# EAGLE board controller (EAGLE 9.6.0)
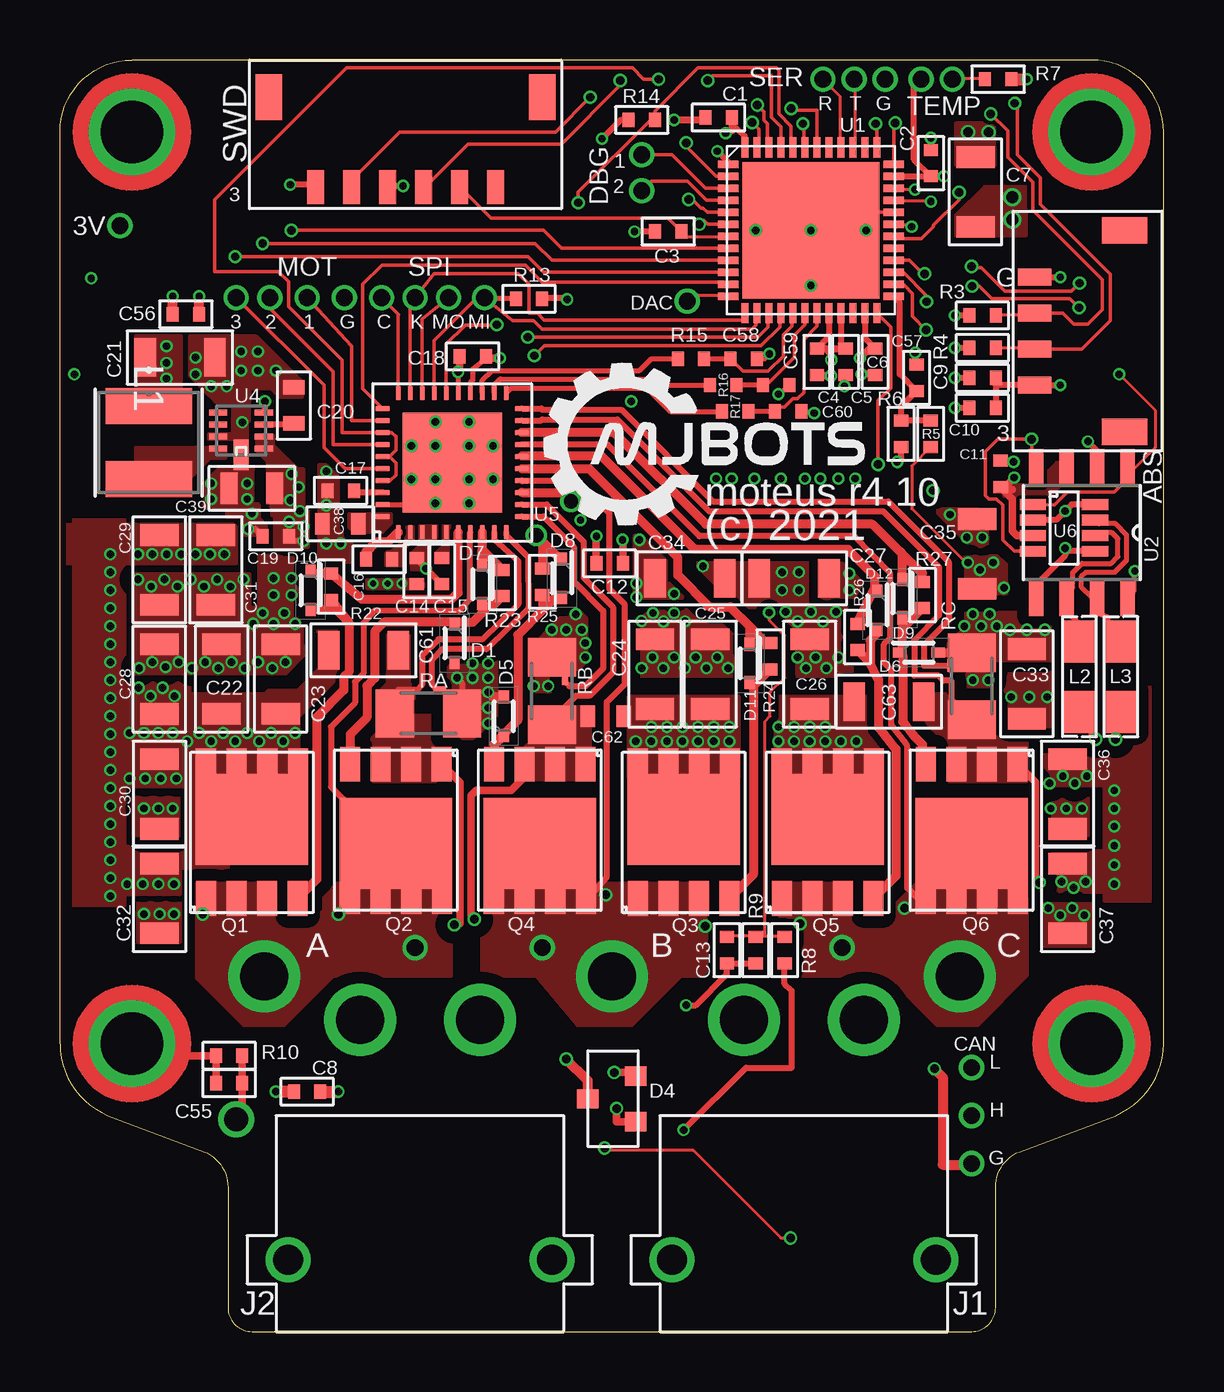
[diagram p5: board, top side]
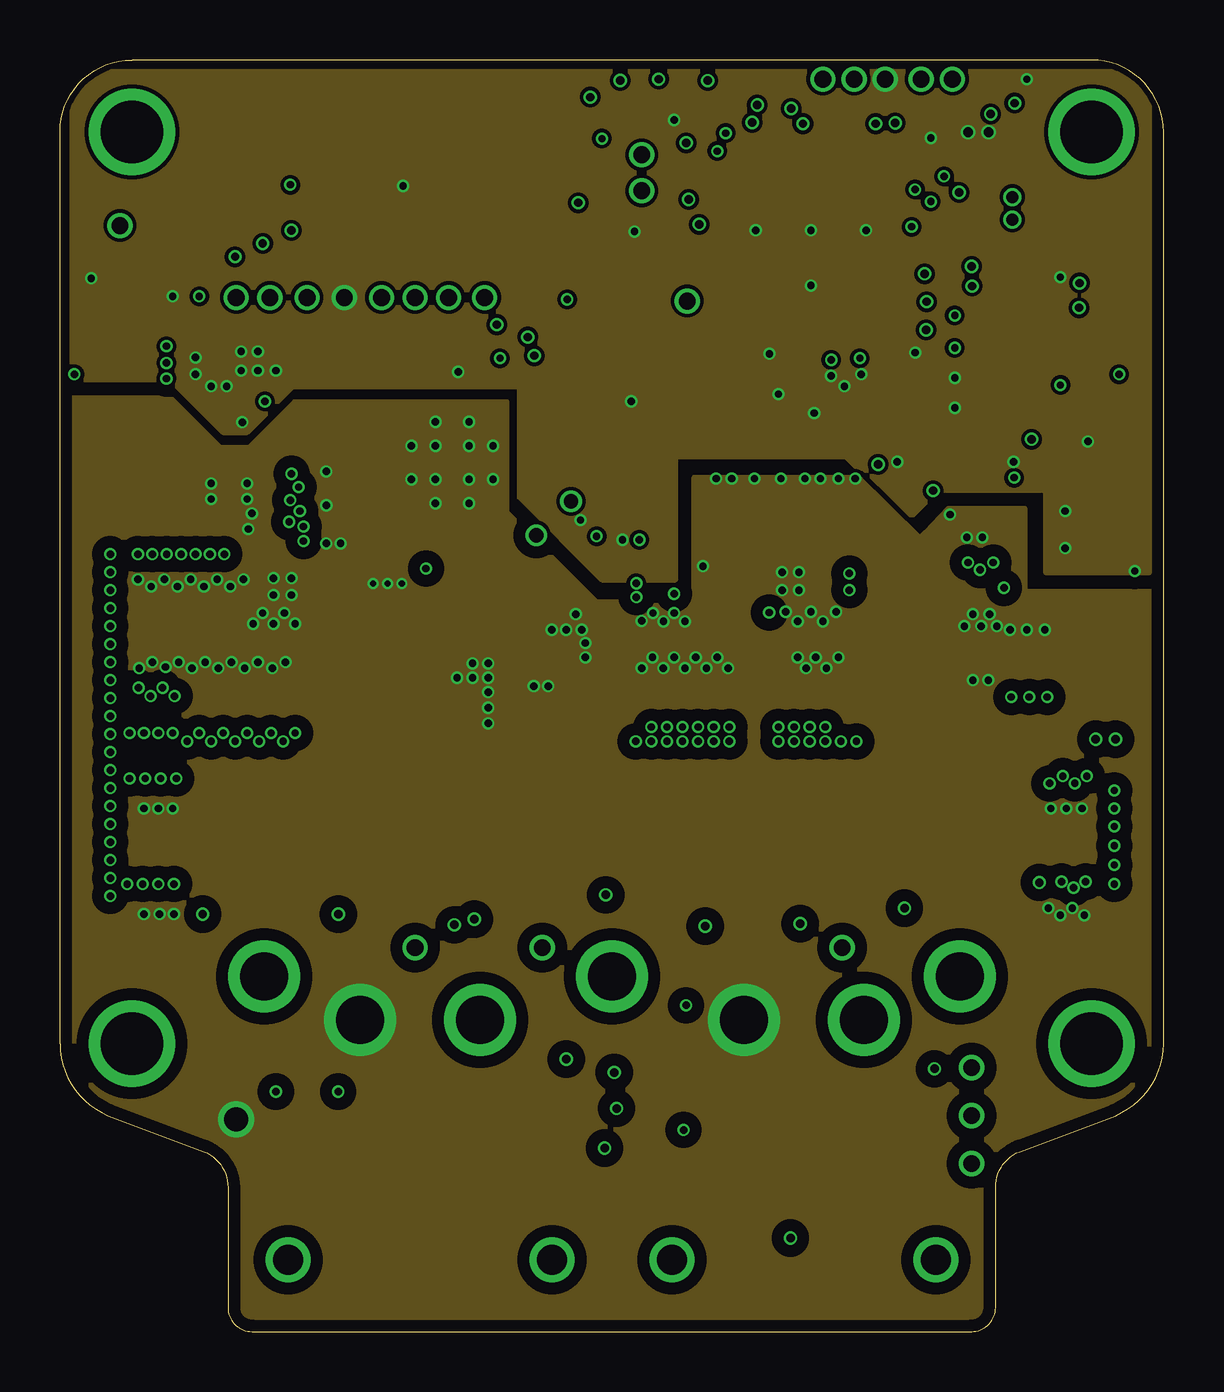
[diagram p6: board, inner layer Route2]
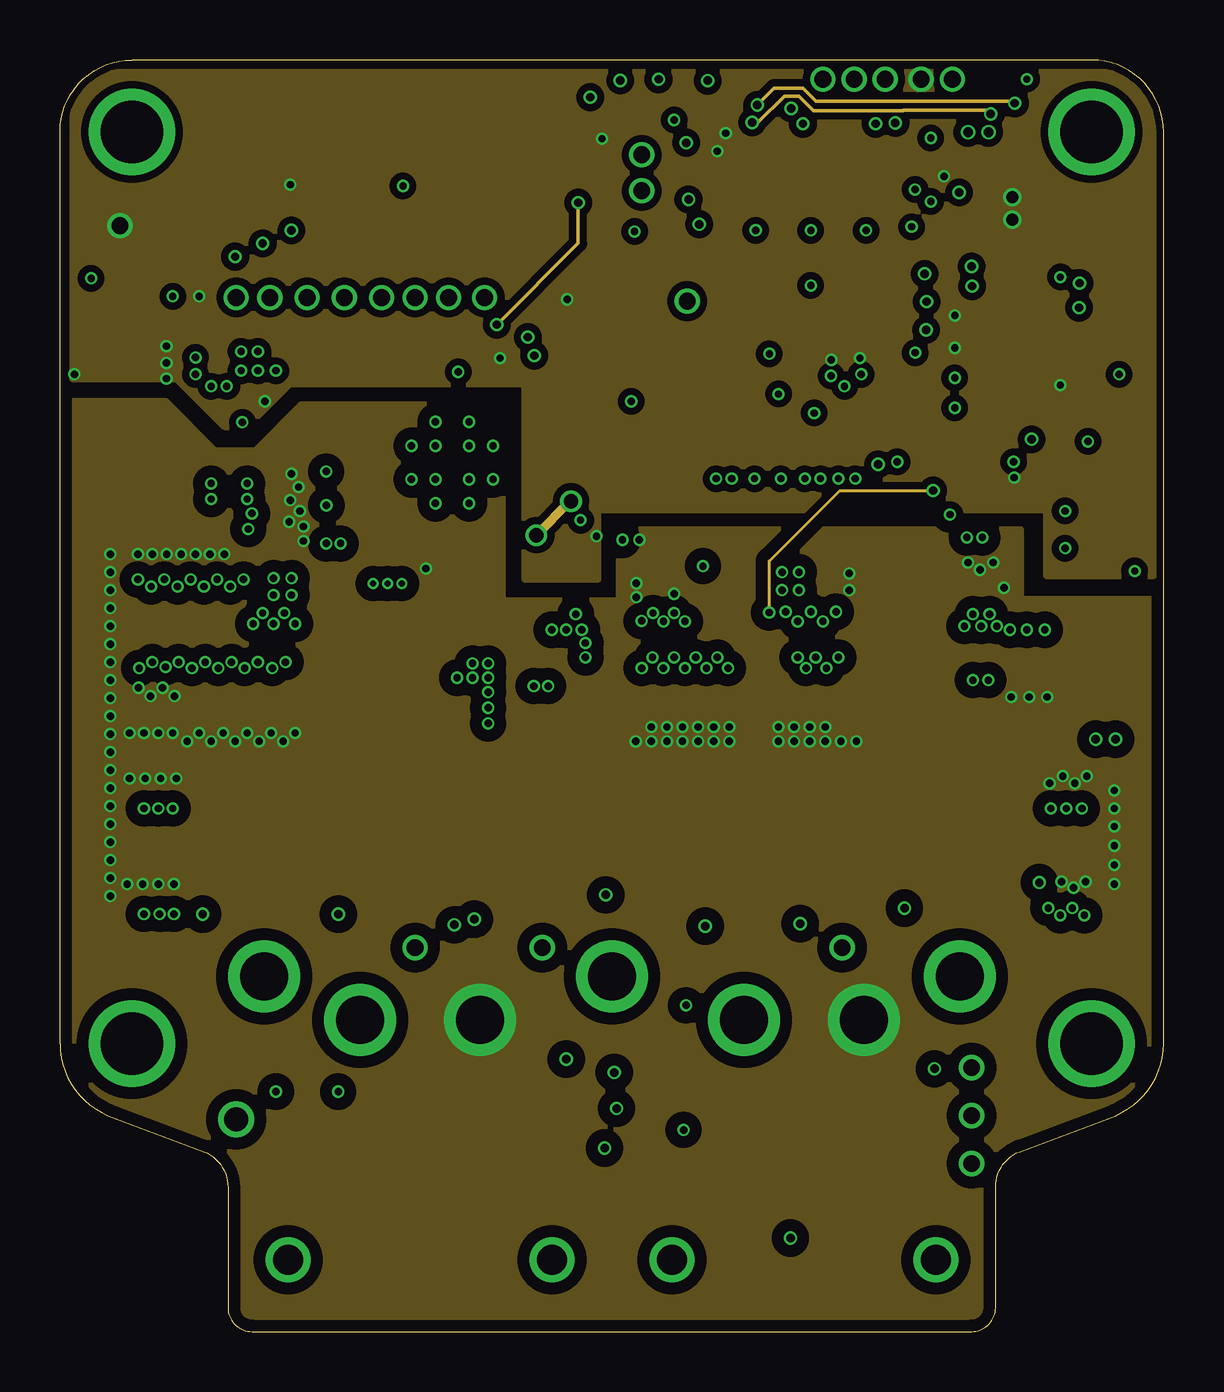
[diagram p7: board, inner layer Route15]
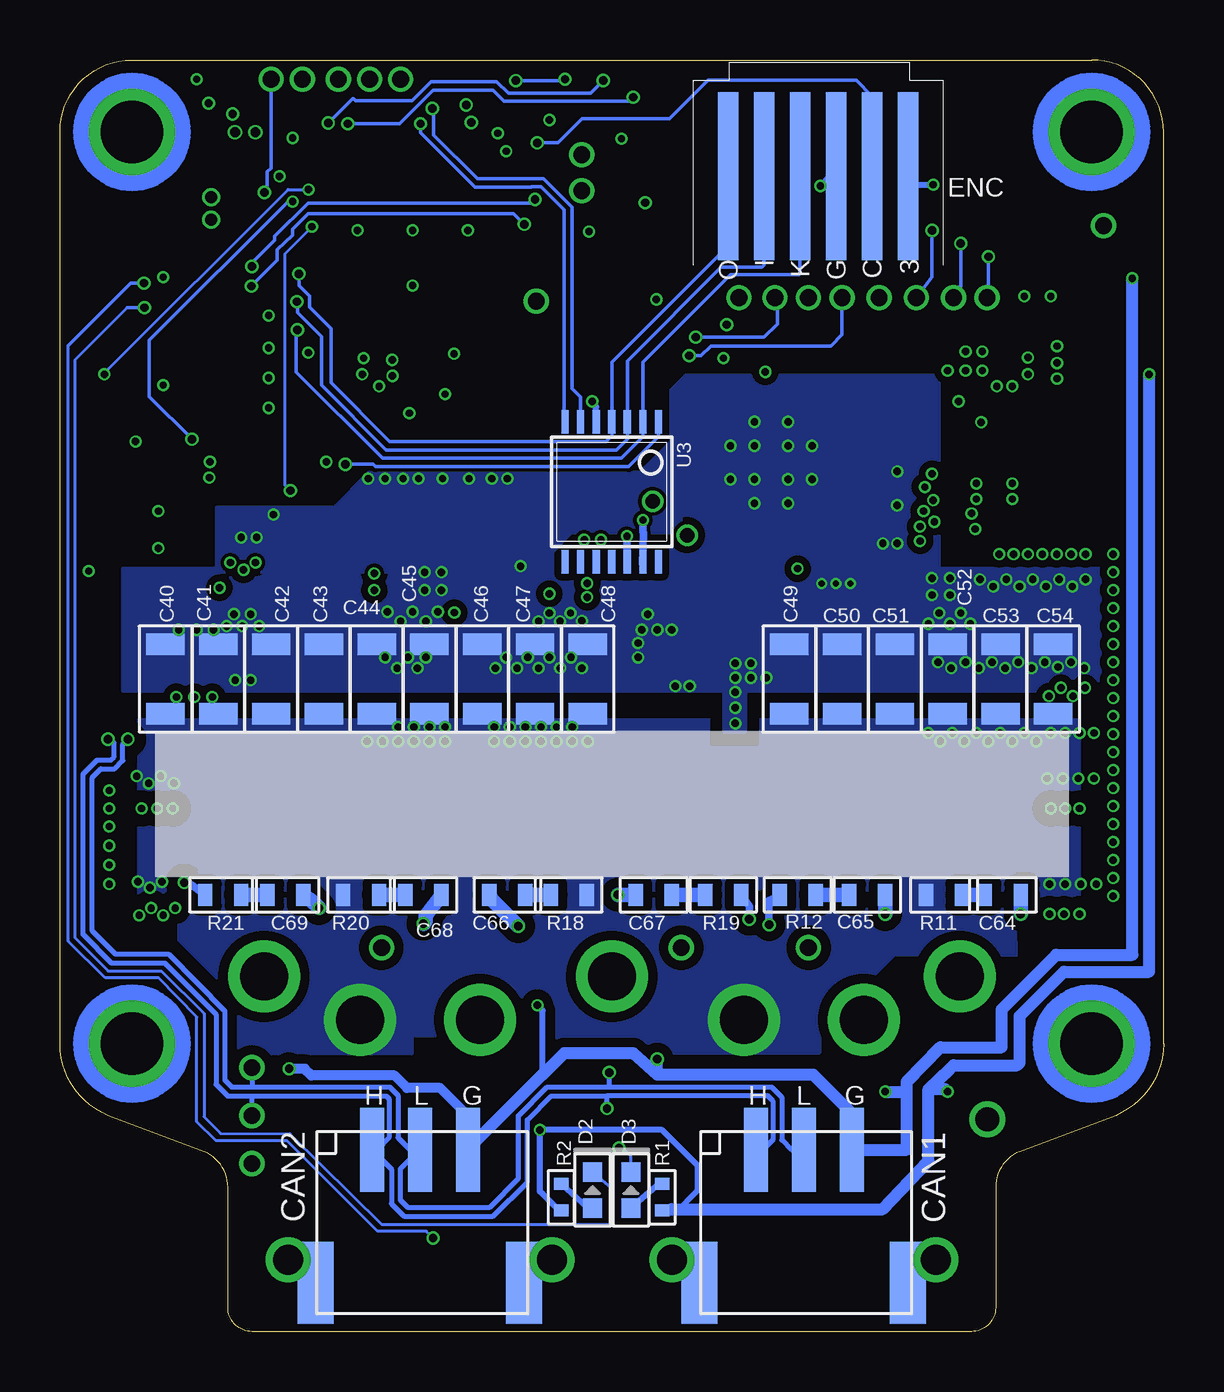
[diagram p8: board, bottom side, seen from below]

Size 46 x 53 mm. Coordinates in mm from the lower left corner, seen from the top.
Outline: 0,12 0,50 arc-90 3,53 43,53 arc-90 46,50 46,12 arc-67 44,9 40,7.5 arc68 39,6 39,1 arc-90 38,0 8,0 arc-90 7,1 7,6 arc68 6,7.5 2,9 arc-67 0,12
Copper layers (1*2*15*16): Top 0.035mm / dielectric 0.23mm / Route2 0.035mm / dielectric 0.93mm / Route15 0.035mm / dielectric 0.23mm / Bottom 0.035mm
Design rules "MF_4_mil_drill_4_Layer *": minimum track width 5mil, minimum drill 10mil, track to track 6mil, track to pad 6mil, pad to pad 6mil, via to via 6mil, smd to smd 0mil, copper to edge 10mil, drill to drill 10mil, minimum pad ring 4mil, minimum via ring 4mil, stop-mask expansion 2mil, vias tented up to drill 25mil, thermal gap 10mil
Net classes: 0 default: width 0.127 mm; 1 CAN: width 0.216 mm, clearance 0.127 mm
bKeepout: area 4,19 to 42,25

## Footprints (pad centres in the part's own frame; a part is rotated, then mirrored left to right if it is on the bottom)
16AWG_PAD = drill 2: 1 0,0
JST_S4B-ZR-SM4A-TF(LF)(SN) = smd 0.7 x 1.4: 1 2.25,-1.27; 2 0.75,-1.27; 3 -0.75,-1.27; 4 -2.25,-1.27 | smd 1.1 x 1.9: P1 4.2,2.48; P2 -4.2,2.48
C0402 = smd 0.5 x 0.6: P$1 -0.55,0; P$2 0.55,0
C1206 = smd 0.9 x 1.6: P$1 -1.45,0; P$2 1.45,0
C0402_NOBORDER = smd 0.5 x 0.6: P$1 -0.55,0; P$2 0.55,0
C0603 = smd 0.6 x 0.9: P$1 -0.75,0; P$2 0.75,0
C1206_NOBORDER = smd 0.9 x 1.6: P$1 -1.45,0; P$2 1.45,0
C0805 = smd 0.7 x 1.3: P$1 -0.95,0; P$2 0.95,0
C1206_NOCREAM = smd 0.9 x 1.6: P$1 -1.45,0; P$2 1.45,0
C0603_NOBORDER = smd 0.6 x 0.9: P$1 -0.75,0; P$2 0.75,0
JST_S3B-PH-SM4-TB(LF)(SN) = smd 1 x 3.5: 1 2,-2.98; 2 0,-2.98; 3 -2,-2.98 | smd 1.5 x 3.4: S1 -4.35,2.57; S2 4.35,2.57
SODFL1608X70N = smd 0.55 x 0.42: 1 -0.8,0; 2 0.8,0
LED0603 = smd 0.8 x 0.8: ANODE 0.75,0; CATHODE -0.75,0
SOT23-3 = smd 0.8 x 0.9: 1 -0.95,-1; 2 0.95,-1; 3 0,1
24AWG_PAD = drill 0.7: P$1 0,0
PICO-SPOX-SMT-RA-6-NOPASTE = smd 0.85 x 7: 1 3.75,0; 2 2.25,0; 3 0.75,0; 4 -0.75,0; 5 -2.25,0; 6 -3.75,0
XT30PW_MALE = drill 2: 1 -2.5,0; 2 2.5,0 | drill 1.25: M1 -5.5,10; M2 5.5,10
IND_BOURNS_SRN4018 = smd 1.499 x 3.607: 1 -1.524,0; 2 1.524,0
1812_COMMON_HALF = smd 1.75 x 1.3: P$1 -1.47,0; P$2 1.47,0
M2.5MOUNT = drill 2.6: P$1 0,0
SOP_ADVANCE_8 = smd 0.85 x 1.45: 1 -1.905,-2.95; 2 -0.635,-2.95; 3 0.635,-2.95; 4 1.905,-2.95 | smd 0.85 x 1.1: 5 1.925,2.75; 6 0.637,2.75; 7 -0.637,2.75; 8 -1.925,2.75 | smd 4.7 x 3.8: PAD 0,0.35
R0402 = smd 0.5 x 0.6: P$1 -0.55,0; P$2 0.55,0
R0603 = smd 0.6 x 0.9: P$1 -0.75,0; P$2 0.75,0
R0402_NOBORDER = smd 0.5 x 0.6: P$1 -0.55,0; P$2 0.55,0
M1206 = smd 1.6 x 2: 1 -1.4,0; 2 1.4,0
SHORT_TOP-50 = smd 0.254 x 0.254: 1 0.127,0; 2 -0.127,0
SHORT_TOP-MEDIUM = smd 0.635 x 0.635: 1 0.318,0; 2 -0.318,0
JST_S6B-ZR-SM4A-TF(LF)(SN) = smd 0.7 x 1.4: 1 3.75,0; 2 2.25,0; 3 0.75,0; 4 -0.75,0; 5 -2.25,0; 6 -3.75,0 | smd 1.1 x 1.9: P1 5.7,3.75; P2 -5.7,3.75
QFN50P700X700X60-49N = smd 0.85 x 0.3: 1 -3.45,2.75; 2 -3.45,2.25; 3 -3.45,1.75; 4 -3.45,1.25; 5 -3.45,0.75; 6 -3.45,0.25; 7 -3.45,-0.25; 8 -3.45,-0.75; 9 -3.45,-1.25; 10 -3.45,-1.75; 11 -3.45,-2.25; 12 -3.45,-2.75; 25 3.45,-2.75; 26 3.45,-2.25; 27 3.45,-1.75; 28 3.45,-1.25; 29 3.45,-0.75; 30 3.45,-0.25; 31 3.45,0.25; 32 3.45,0.75; 33 3.45,1.25; 34 3.45,1.75; 35 3.45,2.25; 36 3.45,2.75 | smd 0.3 x 0.85: 13 -2.75,-3.45; 14 -2.25,-3.45; 15 -1.75,-3.45; 16 -1.25,-3.45; 17 -0.75,-3.45; 18 -0.25,-3.45; 19 0.25,-3.45; 20 0.75,-3.45; 21 1.25,-3.45; 22 1.75,-3.45; 23 2.25,-3.45; 24 2.75,-3.45; 37 2.75,3.45; 38 2.25,3.45; 39 1.75,3.45; 40 1.25,3.45; 41 0.75,3.45; 42 0.25,3.45; 43 -0.25,3.45; 44 -0.75,3.45; 45 -1.25,3.45; 46 -1.75,3.45; 47 -2.25,3.45; 48 -2.75,3.45 | smd 5.7 x 5.7: 49 0,0
SOIC8 = smd 1.549 x 0.61: 1 -2.7,1.905; 2 -2.7,0.635; 3 -2.7,-0.635; 4 -2.7,-1.905; 5 2.7,-1.905; 6 2.7,-0.635; 7 2.7,0.635; 8 2.7,1.905
TSSOP14 = smd 0.305 x 0.991: 1 -1.95,-2.918; 2 -1.3,-2.918; 3 -0.65,-2.918; 4 0,-2.918; 5 0.65,-2.918; 6 1.3,-2.918; 7 1.95,-2.918; 8 1.95,2.918; 9 1.3,2.918; 10 0.65,2.918; 11 0,2.918; 12 -0.65,2.918; 13 -1.3,2.918; 14 -1.95,2.918
21-0487A_MXM = smd 0.762 x 0.254: 1 -0.953,0.75; 2 -0.953,0.25; 3 -0.953,-0.25; 4 -0.953,-0.75; 5 0.953,-0.75; 6 0.953,-0.25; 7 0.953,0.25; 8 0.953,0.75
WQFN-40 = smd 0.22 x 0.6: 1 2.25,2.9; 2 1.75,2.9; 3 1.25,2.9; 4 0.75,2.9; 5 0.25,2.9; 6 -0.25,2.9; 7 -0.75,2.9; 8 -1.25,2.9; 9 -1.75,2.9; 10 -2.25,2.9; 21 -2.25,-2.9; 22 -1.75,-2.9; 23 -1.25,-2.9; 24 -0.75,-2.9; 25 -0.25,-2.9; 26 0.25,-2.9; 27 0.75,-2.9; 28 1.25,-2.9; 29 1.75,-2.9; 30 2.25,-2.9 | smd 0.6 x 0.22: 11 -2.9,2.25; 12 -2.9,1.75; 13 -2.9,1.25; 14 -2.9,0.75; 15 -2.9,0.25; 16 -2.9,-0.25; 17 -2.9,-0.75; 18 -2.9,-1.25; 19 -2.9,-1.75; 20 -2.9,-2.25; 31 2.9,-2.25; 32 2.9,-1.75; 33 2.9,-1.25; 34 2.9,-0.75; 35 2.9,-0.25; 36 2.9,0.25; 37 2.9,0.75; 38 2.9,1.25; 39 2.9,1.75; 40 2.9,2.25 | drill 0.305: P1 -0.7,-1.7; P2 0.7,-1.7; P3 1.7,-0.7; P7 0.7,-0.7; P8 0.7,1.7; P9 -0.7,1.7; P12 -0.7,-0.7; P13 0.7,0.7; P14 -0.7,0.7; P17 -1.7,-0.7; P18 1.7,0.7; P19 -1.7,0.7 | smd 4.15 x 4.15: PAD 0,0
SOT23-8 = smd 0.45 x 1.1: 1 -0.975,-1.3; 2 -0.325,-1.3; 3 0.325,-1.3; 4 0.975,-1.3; 5 0.975,1.3; 6 0.325,1.3; 7 -0.325,1.3; 8 -0.975,1.3

## Placement (x,y rotation side)
A  PAD16AWG_PAD  [16AWG_PAD]  8.5,14.8 0 top
ABS  JST_ZH4  [JST_S4B-ZR-SM4A-TF(LF)(SN)]  41.9,41.7 270 top
B  PAD16AWG_PAD  [16AWG_PAD]  23,14.8 0 top
C  PAD16AWG_PAD  [16AWG_PAD]  37.5,14.8 0 top
C1  0.1uF  [C0402]  27.45,50.6 180 top
C2  0.1uF  [C0402]  36.3,48.7 90 top
C3  0.1uF  [C0402]  25.35,45.85 180 top
C4  1uF  [C0402]  31.55,40.42 270 top
C5  0.1uF  [C0402]  32.75,40.42 270 top
C6  0.1uF  [C0402]  33.98,40.42 270 top
C7  10uF  [C1206]  38.16,47.5 270 top
C8  0.1uF  [C0402]  10.3,10 0 top
C9  1uF  [C0402]  38.45,39.75 180 top
C10  0.1uF  [C0402]  38.45,38.5 180 top
C11  0.1uF  [C0402_NOBORDER]  39.2,35.75 90 top
C12  0.1uF  [C0402]  22.91,32.02 0 top
C13  0.1uF  [C0402]  27.8,15.9 270 top
C14  0.1uF 50V  [C0402]  14.87,31.7 270 top
C15  1uF  [C0402]  15.91,31.7 90 top
C16  0.1uF 50V  [C0402]  13.3,32.18 180 top
C17  1uF  [C0402]  11.7,35.05 0 top
C18  0.1uF  [C0402]  17.2,40.65 0 top
C19  0.47uF 50V  [C0402]  9,33.15 180 top
C20  1uF  [C0603]  9.75,38.6 90 top
C21  10uF  [C1206]  5,40.6 0 top
C22  10uF 50V  [C1206]  6.73,27.2 90 top
C23  10uF 50V  [C1206]  9.2,27.2 90 top
C24  10uF 50V  [C1206]  24.8,27.4 90 top
C25  10uF 50V  [C1206]  27.1,27.4 90 top
C26  10uF 50V  [C1206]  31.25,27.4 90 top
C27  10uF 50V  [C1206]  26.25,31.4 0 top
C28  10uF 50V  [C1206]  4.14,27.19 90 top
C29  10uF 50V  [C1206]  4.14,31.75 270 top
C30  10uF 50V  [C1206]  4.15,22.4 270 top
C31  10uF 50V  [C1206]  6.5,31.75 270 top
C32  10uF 50V  [C1206]  4.15,18.05 270 top
C33  10uF 50V  [C1206]  40.3,27 90 top
C34  10uF 50V  [C1206]  30.6,31.4 180 top
C35  10uF 50V  [C1206_NOBORDER]  38.23,32.41 90 top
C36  10uF 50V  [C1206]  42,22.4 270 top
C37  10uF 50V  [C1206]  42,18.05 270 top
C38  1uF  [C0603]  11.69,33.67 0 top
C39  1uF 100V  [C0805]  8,35.15 180 top
C40  DNP  [C1206_NOCREAM]  41.6,27.2 90 bottom
C41  DNP  [C1206_NOCREAM]  39.4,27.2 90 bottom
C42  DNP  [C1206_NOCREAM]  37.2,27.2 90 bottom
C43  DNP  [C1206_NOCREAM]  35,27.2 90 bottom
C44  DNP  [C1206_NOCREAM]  32.8,27.2 90 bottom
C45  DNP  [C1206_NOCREAM]  30.6,27.2 90 bottom
C46  DNP  [C1206_NOCREAM]  28.4,27.2 90 bottom
C47  DNP  [C1206_NOCREAM]  26.2,27.2 90 bottom
C48  DNP  [C1206_NOCREAM]  24,27.2 90 bottom
C49  DNP  [C1206_NOCREAM]  15.6,27.2 90 bottom
C50  DNP  [C1206_NOCREAM]  13.4,27.2 90 bottom
C51  DNP  [C1206_NOCREAM]  11.2,27.2 90 bottom
C52  DNP  [C1206_NOCREAM]  9,27.2 90 bottom
C53  DNP  [C1206_NOCREAM]  6.8,27.2 90 bottom
C54  DNP  [C1206_NOCREAM]  4.6,27.2 90 bottom
C55  DNP  [C0402]  7.05,10.35 0 top
C56  1uF  [C0402]  5.25,42.4 180 top
C57  0.01uF  [C0402]  35.7,39.75 90 top
C58  1000pF  [C0402_NOBORDER]  28.5,40.55 0 top
C59  1000pF  [C0402_NOBORDER]  29.85,39.45 0 top
C60  1000pF  [C0402_NOBORDER]  30.35,38.35 0 top
C61  0.1uF 50V  [C1206]  12.65,28.4 0 top
C62  0.1uF 50V  [C0603_NOBORDER]  22.75,25.65 180 top
C63  0.1uF 50V  [C1206]  34.55,26.25 0 top
C64  DNP  [C0603]  6.7,18.2 0 bottom
C65  DNP  [C0603]  12.35,18.2 180 bottom
C66  DNP  [C0603]  27.35,18.2 180 bottom
C67  DNP  [C0603]  21.25,18.2 0 bottom
C68  DNP  [C0603]  30.85,18.2 0 bottom
C69  DNP  [C0603]  36.6,18.2 180 bottom
CAN1  JST-PH3  [JST_S3B-PH-SM4-TB(LF)(SN)]  15,4.6 180 bottom
CAN2  JST-PH3  [JST_S3B-PH-SM4-TB(LF)(SN)]  31,4.6 180 bottom
D1  BAT41KFILM  [SODFL1608X70N]  16.45,28.69 270 top
D2  MF-LED-0603-RED  [LED0603]  23.8,5.9 270 bottom
D3  MF-LED-0603-RED  [LED0603]  22.2,5.9 270 bottom
D4  DUAL_TVS  [SOT23-3]  23,9.7 90 top
D5  BAT41KFILM  [SODFL1608X70N]  18.5,25.65 90 top
D6  BAT41KFILM  [SODFL1608X70N]  35.8,28.3 0 top
D7  BAT41KFILM  [SODFL1608X70N]  17.6,31.15 270 top
D8  BAT41KFILM  [SODFL1608X70N]  20.93,31.4 270 top
D9  BAT41KFILM  [SODFL1608X70N]  35.11,30.55 270 top
D10  BAT41KFILM  [SODFL1608X70N]  10.45,30.9 270 top
D11  BAT41KFILM  [SODFL1608X70N]  28.75,27.85 270 top
D12  BAT41KFILM  [SODFL1608X70N]  34.07,30.06 270 top
D33  PAD24AWG_PAD  [24AWG_PAD]  2.5,46.1 0 top
DA  PAD24AWG_PAD  [24AWG_PAD]  14.8,16 0 top
DAC  PAD24AWG_PAD  [24AWG_PAD]  26.15,42.95 270 top
DB  PAD24AWG_PAD  [24AWG_PAD]  20.1,16 0 top
DBG1  PAD24AWG_PAD  [24AWG_PAD]  24.25,49.05 270 top
DBG2  PAD24AWG_PAD  [24AWG_PAD]  24.25,47.55 270 top
DC  PAD24AWG_PAD  [24AWG_PAD]  32.6,16 0 top
DG1  PAD24AWG_PAD  [24AWG_PAD]  11.85,43.1 0 top
DG2  PAD24AWG_PAD  [24AWG_PAD]  34.4,52.2 0 top
DRV_CS  PAD24AWG_PAD  [24AWG_PAD]  13.4,43.1 0 top
DRV_MISO  PAD24AWG_PAD  [24AWG_PAD]  17.7,43.1 0 top
DRV_MOSI  PAD24AWG_PAD  [24AWG_PAD]  16.2,43.1 0 top
DRV_SCK  PAD24AWG_PAD  [24AWG_PAD]  14.8,43.1 0 top
DTR  PAD24AWG_PAD  [24AWG_PAD]  31.8,52.2 270 top
DTX  PAD24AWG_PAD  [24AWG_PAD]  33.1,52.2 270 top
ENC  PICO-SPOX-6NOPASTE  [PICO-SPOX-SMT-RA-6-NOPASTE]  14.4,48.15 0 bottom
J1  XT30XT30PW_MALE  [XT30PW_MALE]  31,13 180 top
J2  XT30XT30PW_MALE  [XT30PW_MALE]  15,13 180 top
L1  SRN4018-220M  [IND_BOURNS_SRN4018]  3.7,37.05 270 top
L2  HALF_CHOKE  [1812_COMMON_HALF]  42.5,27.3 90 top
L3  HALF_CHOKE  [1812_COMMON_HALF]  44.23,27.3 90 top
M1  MOUNT  [M2.5MOUNT]  3,50 0 top
M2  MOUNT  [M2.5MOUNT]  43,50 0 top
M3  MOUNT  [M2.5MOUNT]  3,12 0 top
M4  MOUNT  [M2.5MOUNT]  43,12 0 top
MOT1  PAD24AWG_PAD  [24AWG_PAD]  10.3,43.1 0 top
MOT2  PAD24AWG_PAD  [24AWG_PAD]  8.75,43.1 0 top
MOT3  PAD24AWG_PAD  [24AWG_PAD]  7.35,43.1 0 top
Q1  TPH1R204PLSOP_ADVANCE_8  [SOP_ADVANCE_8]  8,21 0 top
Q2  TPH1R204PLSOP_ADVANCE_8  [SOP_ADVANCE_8]  14,20.7 180 top
Q3  TPH1R204PLSOP_ADVANCE_8  [SOP_ADVANCE_8]  26,21 0 top
Q4  TPH1R204PLSOP_ADVANCE_8  [SOP_ADVANCE_8]  20,20.7 180 top
Q5  TPH1R204PLSOP_ADVANCE_8  [SOP_ADVANCE_8]  32,21 0 top
Q6  TPH1R204PLSOP_ADVANCE_8  [SOP_ADVANCE_8]  38,20.7 180 top
R1  560  [R0402]  20.9,5.6 90 bottom
R2  560  [R0402]  25.1,5.6 90 bottom
R3  2k  [R0402]  38.45,42.35 0 top
R4  2k  [R0402]  38.45,41 0 top
R5  100k 1%  [R0402]  36.29,37.42 270 top
R6  4.7k 1%  [R0402]  35.06,37.42 90 top
R7  10k 1%  [R0402]  39.1,52.2 0 top
R8  47k NTC  [R0402]  30.2,15.9 90 top
R9  10k 1%  [R0402]  29,15.9 270 top
R10  DNP  [R0402]  7.05,11.5 0 top
R11  DNP  [R0603]  9.15,18.2 0 bottom
R12  DNP  [R0603]  15.25,18.2 180 bottom
R13  2k  [R0402]  19.55,43.05 180 top
R14  2k  [R0402]  24.25,50.5 0 top
R15  22  [R0402_NOBORDER]  26.3,40.55 0 top
R16  22  [R0402_NOBORDER]  27.65,39.45 0 top
R17  22  [R0402_NOBORDER]  28.15,38.35 0 top
R18  DNP  [R0603]  24.8,18.2 180 bottom
R19  DNP  [R0603]  18.35,18.2 0 bottom
R20  DNP  [R0603]  33.45,18.2 0 bottom
R21  DNP  [R0603]  39.2,18.2 180 bottom
R22  0  [R0402]  11.3,31.05 270 top
R23  0  [R0402]  18.45,31.2 270 top
R24  0  [R0402]  29.6,28.15 270 top
R25  0  [R0402]  20.11,31.25 270 top
R26  0  [R0402]  33.24,28.95 270 top
R27  0  [R0402]  35.95,30.7 270 top
RA  0.5mOhm 1% 2W  [M1206]  15.36,25.77 180 top
RB  0.5mOhm 1% 2W  [M1206]  20.5,26.7 270 top
RC  0.5mOhm 1% 2W  [M1206]  38,26.9 270 top
SH1  SHORTT5  [SHORT_TOP-50]  15.84,26.75 180 top
SH2  SHORTT5  [SHORT_TOP-50]  21.05,27.21 270 top
SH3  SHORTT5  [SHORT_TOP-50]  37.12,27.77 270 top
SH4  SHORTMEDIUM  [SHORT_TOP-MEDIUM]  7.55,36.55 270 top
SWD  JST-ZH6  [JST_S6B-ZR-SM4A-TF(LF)(SN)]  14.4,47.7 0 top
TEMP1  PAD24AWG_PAD  [24AWG_PAD]  35.9,52.2 0 top
TEMP2  PAD24AWG_PAD  [24AWG_PAD]  37.2,52.2 0 top
U1  STM32G474CEU6  [QFN50P700X700X60-49N]  31.3,45.9 0 top
U2  TCAN334G  [SOIC8]  42.6,33.3 270 top
U3  AS5147  [TSSOP14]  23,35 180 bottom
U4  MAX15062AATA+T  [21-0487A_MXM]  7.55,37.55 180 top
U5  DRV8353S  [WQFN-40]  16.35,36.22 180 top
U6  TCAN334GSOT23  [SOT23-8]  41.85,33.5 270 top

## Tracks (layer width: path | path; a pad name or v marks a point on that pad's centre or on a via)
+3V3  (via drill 0.3, 0.5)
  Top 0.152: C11.P$1 39.39,35.2
  Top 0.216: U5.24 17.1,39.55 17.2,39.65 17.2,40.1 17.75,40.55 C18.P$2
  Top 0.254: SWD.6 10.55,47.7 10.46,47.79 10.46,47.8 v9.6,47.8 | v26,8.4 28.59,11 30.5,11 30.5,14.2 30.2,14.5 R8.P$1 | U1.23 33.55,41.4 C6.P$1 | U1.21 32.55,41.17 C5.P$1 | U1.20 32.05,41.47 C4.P$1 | U1.1 27.85,48.75 v27.4,49.2 | U1.48 28.55,49.83 28,50.33 C1.P$1 | U1.35 C2.P$1 35.6,48.85 35.6,51.9 TEMP1.P$1 | R14.P$1 23.37,50.5 v22.59,49.72 | R13.P$1 20.08,43.07 21.09,43.07 v21.14,43.02 | v41.7,39.45 ABS.1 39,39.45 C9.P$1 C10.P$1 | R3.P$1 v37.3,42.35 | R4.P$1 v37.3,41 | U4.4 8.54,38.34 v8.54,38.77 | U2.3 41.9,36.06
  Top 0.3: C1.P$1 28,50.05 27.82,50 27.79,49.99 v27.75,49.95 | C2.P$1 v36.85,48.15 | C6.P$1 33.74,40.97 v33.34,40.57 | v32.15,40.5 32.15,40.72 31.9,40.97 C4.P$1 C5.P$1
  Top 0.305: C12.P$1 22.35,33.14 v22.36,33.15 | C18.P$2 17.83,40.57 v18.34,40.57 | C11.P$1 39.7,34.7 39.7,33.37 39.89,33.17 U6.3 | 41.97,35.76 U2.3 | v39.77,35.59 39.39,35.2 39.28,35.1 39.7,35.1
  Top 0.406: C56.P$1 v5.8,43.15
  Top 0.5: C8.P$1 v9,10
  Bottom 0.254: R2.P$1 25.2,5.05 26,5.84 v26,8.4 20.9,8.4 19.4,6.9 19.4,5.9 20.35,4.95 R1.P$1 | ENC.1 10.3,47.8 v9.6,47.8
  Bottom 0.305: U3.12 22.36,32.1 v22.36,33.15
  Bottom 0.5: R1.P$1 20.5,5.1 11.7,5.1 9.8,7.1 9.8,10.1 | 9.8,10.1 8.9,10.95 8.75,11.1 6.1,11.1 6,11.2 6,13.15 4.15,15 0.6,15 v0.6,39.9 | v9,10 9.1,10.1 9.8,10.1
  other vias: 39.7,46.34 39.7,47.29 4.44,41.07 4.44,40.37 4.44,39.72
  pour Route15 (isolate 0.3, no thermals): 0.5,39.7 4.85,39.7 6.85,37.7 7.8,37.7 9.6,39.5 19.35,39.5 19.35,31.35 22.45,31.35 22.45,34.25 41.1,34.25 41.1,31.5 45.6,31.5 45.6,52.5 0.5,52.5
  pour Top (no thermals): 37.35,46.55 38.55,47.75 40.25,47.75 40.25,45.65 37.35,45.65
  pour Top (no thermals): 3.15,41.5 5.05,41.5 5.05,38.65 3.15,38.65
  pour Top (no thermals): 39.35,35.3 40.6,35.3 41.55,36.25 42.05,36.25 42.05,35.25 41.7,35.25 41.25,34.8 39.35,34.8
AS5047_A  (via drill 0.35)
  Top 0.152: U1.43 31,49.4 31,50.34 v30.97,50.34
  Bottom 0.127: 25,38 U3.7
  Bottom 0.152: v30.97,50.34 30.97,49.97 28.7,47.7 26.36,47.7 26.35,47.71 25.95,47.71 25,46.76 25,38
AS5047_B  (via drill 0.35)
  Top 0.152: U1.42 31.55,50.9 30.56,50.9 v30.48,50.98
  Bottom 0.152: v30.48,50.98 30.48,50.96 30.42,50.9 30.42,49.87 28.6,48.05 25.84,48.05 24.65,46.86 24.65,39.3 24.3,38.95 U3.6
AS5047_CS  (via drill 0.35)
  Top 0.152: v34.1,36.15 34.1,38.8 34.63,39.33 34.63,41.87 U1.24
  Bottom 0.152: U3.1 21.05,37.3 22.3,36.05 32.85,36.05 32.95,36.15 v34.1,36.15
AS5047_MISO  (via drill 0.35)
  Top 0.152: U1.27 35.15,44.15 36.12,43.18 v36.12,42.92
  Bottom 0.152: v36.12,42.92 36.1,42.91 36.1,42.47 35.1,41.47 35.1,39.45 32.4,36.75 22.8,36.75 22.35,37.2 U3.3 22.35,40.45 18.44,44.36 16.74,44.36 16.65,44.45 ENC.5
AS5047_MOSI  (via drill 0.35)
  Top 0.152: U1.28 35.4,44.65 35.96,44.09 v36.04,44.09
  Bottom 0.152: v36.04,44.09 36.04,43.59 35.6,43.15 35.6,42.7 34.7,41.8 34.7,39.55 32.26,37.1 23.25,37.1 23,37.35 U3.4 23,40.4 18.15,45.25 ENC.6
AS5047_SCK  (via drill 0.35)
  Top 0.152: U1.26 34.79,43.61 35.19,43.61 35.53,43.27 35.53,42.31 v36.1,41.75
  Bottom 0.152: v36.1,41.75 36.15,41.7 36.15,40 32.55,36.4 22.6,36.4 21.7,37.3 U3.2 21.7,40.4 18.05,44.05 15.2,44.05 15.15,44.1 ENC.4
CAN2_N
  Top 0.216: L2.P$2 42.5,29.46 41.97,30 U2.6 41.97,30.75 42.22,31 42.22,31.64 42.6,32.02 43.82,32.02 44.1,32.3 44.1,33.05 43.85,33.3 43.27,33.3 U6.6
CAN2_P
  Top 0.216: L3.P$2 44.23,28.9 43.68,29.57 43.68,29.76 43.28,29.93 43.28,30.55 U2.7 43,30.6 42.58,31.02 42.58,31.48 42.75,31.65 43.97,31.65 44.47,32.15 44.47,33.2 44,33.67 43.31,33.67 U6.7
CAN_N  (via drill 0.35, 0.7)
  Top 0.216: v43.17,24.69 42.97,24.89 42.97,25.49 L2.P$1
  Top 0.305: D4.2 23.75,10.8 v23.1,10.8
  Bottom 0.216: CAN1.2 15.51,7.58 15.91,7.98 15.91,9.77 16.33,10.19 23.06,10.19 | 38,10.2 38.85,10.2 39.13,10.48 39.13,13.36 41.47,15.74 43.69,15.74 44.65,16.69 44.65,23.1 44.3,23.45 43.73,23.45 43.38,23.8 43.38,24.47 v43.17,24.69 | 38,10.2 32.25,10.2 31.91,9.85 31.91,8.08 31.41,7.58 CAN2.2 31.81,6.77 31.81,5.49 31.51,5.19 28.08,5.19 26.89,6.38 26.89,8.99 25.69,10.19 23.06,10.19 | v38,11 38,10.2 | v23.1,10.8 23.1,10.23 23.06,10.19
CAN_P  (via drill 0.35, 0.7)
  Top 0.216: v44,24.69 44,25.68 L3.P$1
  Top 0.305: v23.2,9.3 23.2,8.75 D4.1
  Bottom 0.216: CAN1.1 16.69,7.58 16.29,7.98 16.29,9.61 16.49,9.81 23.21,9.81 | 38.04,9.82 39.02,9.82 39.5,10.3 39.5,13.21 41.64,15.36 43.86,15.36 45.04,16.54 45.04,23.23 44.45,23.82 43.88,23.82 43.75,23.95 43.75,24.54 v44,24.69 | 38.04,9.82 32.41,9.82 32.29,9.7 32.29,8.09 32.79,7.58 CAN2.1 32.19,6.77 32.19,5.33 31.66,4.8 27.94,4.8 26.51,6.23 26.51,8.83 25.53,9.81 23.21,9.81 | v38,9 38,9.78 38.04,9.82 | v23.2,9.3 23.2,9.8 23.21,9.81
CAN_RX  (via drill 0.3, 0.35)
  Top 0.127: v36.3,47.1 36.3,47.12 34.75,47.12 U1.33
  Top 0.152: U2.4 40.5,36.2 v40.5,37.19 39.09,37.19 38.57,36.67 38.57,34.85 38.73,34.7 39.03,34.7 39.31,34.44 39.3,34.42 39.3,33 39.77,32.52 U6.4
  Bottom 0.152: v36.3,47.1 36.5,47.1 42.27,41.33 42.27,38.97 v40.5,37.19
CAN_TX  (via drill 0.3)
  Top 0.127: v35.64,47.6 34.75,47.6 U1.34 | v44.15,39.9 45.65,38.4 45.65,36.84 44.8,36 U2.1
  Top 0.152: U2.1 44.5,35.55 43.95,35 42,35 41.45,34.45 40.4,34.47 U6.1
  Bottom 0.127: v44.15,39.9 44.15,39.95 36.5,47.6 v35.64,47.6
CUR1
  Top 0.203: U5.23 17.6,39.65 18.01,40.06 24.16,40.06 24.65,40.55 R15.P$1
CUR2
  Top 0.203: U5.22 18.1,39.45 18.35,39.7 25,39.7 25.25,39.45 R16.P$1
CUR3
  Top 0.203: U5.21 18.79,39.31 24.49,39.31 25.45,38.35 R17.P$1
DAC
  Top 0.127: U1.12 27.8,43.2 26.6,43.2 26.6,42.95 DAC.P$1
DEBUG1
  Top 0.152: U1.3 26.9,47.65 25.5,49.05 DBG1.P$1
DEBUG2
  Top 0.152: U1.4 26.95,47.15 26.15,47.95 24.65,47.95 DBG2.P$1
DEBUG_RX
  Top 0.127: DTR.P$1 32.5,51.5 32.5,49.38 U1.40
DEBUG_TX
  Top 0.127: U1.39 33.12,49.38 33.12,52.12 DTX.P$1
DRV8323_CS  (via drill 0.35)
  Top 0.127: U1.16 30,42.38
  Top 0.152: U5.30 14.1,42.35 14.12,42.38 DRV_CS.P$1 | 30,42.38 30,41.88 29.23,41.1 20.2,41.1 v19.77,40.67
  Bottom 0.152: v19.77,40.67 19.27,40.67 18.88,41.08 13.88,41.08 13.4,41.55 DRV_CS.P$1
DRV8323_MISO
  Top 0.127: U1.14 29,42.38
  Top 0.152: U5.27 15.6,41.3 17.6,43.3 DRV_MISO.P$1 18.87,42.13 19.75,42.13 20.1,41.78 28.84,41.78 29,41.94 29,42.38
  Top 0.216: R13.P$2 17.75,43.05 DRV_MISO.P$1
DRV8323_MOSI  (via drill 0.35)
  Top 0.127: U1.15 29.5,42.38
  Top 0.152: U5.28 15.1,42.2 DRV_MOSI.P$1 | 29.5,42.38 29.5,41.85 29.09,41.45 v19.5,41.45
  Bottom 0.152: v19.5,41.45 16.65,41.45 16.1,42 16.1,43.2 DRV_MOSI.P$1
DRV8323_SCLK
  Top 0.127: U1.13 28.55,42.15
  Top 0.152: U5.29 14.6,43.1 DRV_SCK.P$1 15.6,44.1 19.1,44.1 19.55,43.66 19.55,42.77 19.55,42.76 19.55,42.45 19.9,42.45 20.18,42.15 28.55,42.15
FCUR1
  Top 0.152: C58.P$1 28.48,40.02 29.52,40.02 30.15,40.65 30.15,41.55 30.5,41.9 30.5,42.4
  Top 0.203: 30.5,42.4 U1.17 | R15.P$2 C58.P$1
FCUR2
  Top 0.152: C59.P$1 29.45,39.45 30.61,40.61 30.61,41.52 31.05,41.97 U1.18
  Top 0.203: C59.P$1 R16.P$2
FCUR3
  Top 0.152: C60.P$1 29.98,38.53 30.2,38.53 30.55,38.88 30.75,38.88 31,39.13 31,41.35 31.55,41.9 U1.19
  Top 0.203: C60.P$1 R17.P$2
GHA
  Top 0.381: U5.6 16.6,30.8 16.31,30.52 12.73,30.52 12.59,30.52 R22.P$1 10.55,31.6 D10.1
GHA_D
  Top 0.381: R22.P$2 12.05,29.55 | Q1.4 10.7,18.84 10.7,25.6 11.83,26.73 11.83,27.28 12.05,27.5 12.05,29.55 | D10.2 11.5,30.1 12.05,29.55
GHB
  Top 0.33: 19.27,35.95 U5.15
  Top 0.381: 19.27,35.95 22.07,35.95 25.75,32.27 25.75,31.53 27.08,30.2 27.93,30.2 28.75,29.38 | 28.75,29.38 29.43,28.7 R24.P$1 | D11.1 28.75,29.38
GHB_D
  Top 0.381: R24.P$2 28.9,26.9 | 28.9,26.9 28.9,19.05 Q3.4 | D11.2 28.9,26.9
GHC
  Top 0.33: 19.27,36.49 U5.16
  Top 0.381: 19.27,36.49 22.57,36.49 26.46,32.6 32.85,32.6 33.95,31.5 33.95,30.99 | 33.95,30.99 33.24,29.6 R26.P$1 | D12.1 33.95,30.98 33.95,30.99
GHC_D
  Top 0.381: R26.P$2 33.75,27.89 33.78,27.84 | 33.78,27.84 34.08,27.21 34.13,27.16 34.13,25.17 34.85,24.26 | 34.85,24.26 | Q5.4 34.85,19 34.85,24.26 | D12.2 34.07,29.11 33.78,28.82 33.78,27.84
GLA
  Top 0.381: U5.8 D7.1 17.6,32.59 R23.P$1
GLA_D
  Top 0.381: 16.63,29.57 17.21,29.57 17.75,30.11 17.75,30.2 | 16.63,29.57 16.55,29.57 13.52,29.57 13.12,29.17 13.12,27.23 12.8,26.91 12.8,25.6 12.1,24.89 Q2.4 | D1.1 16.53,29.57 16.62,29.57 16.63,29.57 | D7.2 17.75,30.2 | 17.75,30.2 18,30.2 R23.P$2
GLB  (via drill 0.6)
  Top 0.381: U5.13 20.93,34.97 v21.3,34.61 | v19.86,33.19 20.11,32.94 | 20.11,32.94 R25.P$1 | D8.1 20.84,32.2 20.11,32.94
  Route15 0.381: v19.86,33.19 19.86,33.2 21.25,34.61 v21.3,34.61
GLB_D
  Top 0.381: R25.P$2 20.11,30.06 | 20.11,30.06 19.09,29.04 19.09,25.48 18.09,24.5 Q4.4 18.09,24.45 D5.1 | D8.2 20.64,30.6 20.11,30.06
GLC
  Top 0.381: U5.18 23.1,37.47 26.92,33.65 33.86,33.65 35.04,32.49 | R27.P$1 35.95,31.6 35.04,32.49 | D9.1 35.11,32.42 35.04,32.49
GLC_D
  Top 0.381: 35.55,24.89 35.67,24.74 35.96,24.45 35.96,23.79 Q6.4 | 35.55,24.89 | 35.55,24.89 35.3,25.21 35.27,25.24 35.13,25.42 35.13,28.16 D6.1 35.1,28.4 35.1,29.3 35.11,29.31 | R27.P$2 35.11,29.31 | D9.2 35.11,29.31
GND  (via drill 0.3, 0.35, 0.4, 0.7)
  Top 0.152: U1.32 33.6,46.65 v33.6,45.9
  Top 0.203: C58.P$2 29.37,40.55 v29.57,40.76 | C59.P$2 30.02,39.08 v29.95,39.08 | C60.P$2 31.38,38.35 v31.44,38.28
  Top 0.216: 40.51,30.79 U2.5 | v44.8,31.7 44.75,31.65 44.75,31.59 44.75,30.85 U2.8 | v16.6,40 U5.25
  Top 0.254: v26.1,13.6 26.5,13.6 27.8,14.9 C13.P$2 R9.P$2 | C3.P$2 v23.95,45.85 | ABS.4 v41.7,43.95 | C9.P$2 v37.3,39.75 | C10.P$2 v37.3,38.5 | v39.75,36.25 39.7,36.3 C11.P$2 | U2.2 43.23,36.72 v42.85,37.1 | R6.P$1 35.06,36.41 v34.9,36.25 | v14.3,47.75 13.7,47.75 SWD.4 | C57.P$2 35.65,40.35 v35.65,40.8 | U6.8 42.17,34.48 v41.9,34.2 41.52,33.83 U6.2 | U6.5 42.02,32.52 v41.9,32.65 41.9,32.35 40.51,30.96 40.51,30.79
  Top 0.3: C1.P$2 26.79,50.6 26.75,50.5 v25.6,50.5 | v36.3,49.75 C2.P$2 | C5.P$2 32.7,39.82 v32.7,39.4 | C6.P$2 33.76,39.87 33.74,39.88 33.72,39.9 v33.4,39.9
  Top 0.305: v23.45,33 v23.46,32.99 C12.P$2 | C20.P$2 9.45,39.35 | v32.14,39.84 31.59,39.84 C4.P$2 | C18.P$1 16.65,40.05 v16.6,40
  Top 0.406: v36.45,10.95 36.8,10.6 36.8,6.95 37.95,6.95 v38,7 | D4.3 22,10.45 v21.1,11.35 | C56.P$2 v4.7,43.15
  Top 0.5: C8.P$2 v11.6,10 | R7.P$2 v40.3,52.2
  Bottom 0.254: 25.88,10.7 25.88,10.73 25.88,13.38 v26.1,13.6 | U3.5 23.65,38.55 23.81,38.71 v23.81,38.77 | ENC.3 13.9,48.15 v14.3,47.75
  Bottom 0.305: U3.13 21.72,32 21.68,33.3 21.7,33.33 v21.7,33.82
  Bottom 0.406: CAN2.3 29,9 30.15,10.15 31.53,10.15 32.05,10.67 35.52,10.67 35.8,10.95 v36.45,10.95 | v21.1,11.35 21.1,10.7
  Bottom 0.5: 10.7,10 10.7,7.58 CAN1.3 13,9.1 14.6,10.7 21.1,10.7 22.1,11.6 24.98,11.6 25.88,10.7 | 10.7,10 10.7,10.4 9.29,11.85 6.75,11.85 6.75,13.43 4.48,15.7 1.3,15.7 v1.3,43.9 | v11.6,10 10.7,10 | CAN2.3 29,7.6 25.88,10.73
  other vias: 38.7,49.99 37.85,49.99 31.3,45.9 29,45.9 31.3,43.6 5.65,39.9 6.3,39.4 6.95,39.4 7.6,37.9 5.65,40.6 7.55,40.85 7.55,40.05 8.25,40.85 8.25,40.05 9,40.05
  pour Route2 (rank 2, no thermals): 0.5,39.7 4.6,39.7 6.8,37.5 7.8,37.5 9.7,39.4 19.15,39.4 19.15,34.8 22.6,31.35 25.65,31.35 25.65,36.5 32.75,36.5 35.4,33.89 35.45,33.95 36.2,34.7 36.6,35.1 41,35.1 41.1,35 41.1,31.65 45.4,31.65 45.4,52.5 0.5,52.5
  pour Top (no thermals): 38.95,48.59 37.35,48.59 37.35,50.39 38.95,50.39
  pour Top (no thermals): 6.2,37.4 7.2,37.4 7.2,38.1 7.8,38.1 7.8,36.8 7.3,36.8 7.3,37.2 6.2,37.2
  pour Top (no thermals): 5.4,41.5 8.15,41.5 8.15,40.5 7.9,40.25 7.9,38.8 6.45,38.8 5.4,39.85
  pour Top (no thermals): 6.05,39.25 6.5,38.8 7.1,38.8 7.25,38.65 7.25,38 7.85,38 7.85,38.7 7.45,39.1 7.45,39.25
  pour Top (no thermals): 8.2,41.5 10.1,39.6 10.1,38.95 9.15,38.95 8.8,39.3 7.4,39.3 6.85,39.85 6.85,40.15
I2C_ABS_SCL  (via drill 0.35)
  Top 0.127: R4.P$2 40.62,41 ABS.2
  Top 0.152: ABS.2 42.6,40.95 43.78,42.13 43.78,44.07 40.86,46.99 40.86,48.09 39.9,49.05 39.9,51.1 v39.8,51.2 | v29.07,51.13 29.35,50.85 29.35,50.49 29.5,50.35 29.5,49.41 U1.46
  Route15 0.152: v39.8,51.2 39.8,51.28 31.52,51.28 30.97,51.83 29.77,51.83 v29.07,51.13
I2C_ABS_SDA  (via drill 0.35)
  Top 0.127: R3.P$2 39,42.38 40.62,42.38 ABS.3 | 29.12,49.38 U1.47
  Top 0.152: ABS.3 41.8,42.45 42.25,42 42.85,42 43.45,42.6 43.45,43.85 40.55,46.75 40.55,47.9 39.5,48.95 39.5,50.05 v38.8,50.75 | v28.85,50.4 29.12,50.12 29.12,49.38
  Route15 0.152: v38.8,50.75 38.65,50.9 35.16,50.9 35.16,50.89 31.41,50.89 30.8,51.5 30.2,51.5 29.1,50.4 v28.85,50.4
LED1  (via drill 0.35)
  Top 0.127: v22.7,7.65 22.8,7.55 26.4,7.55 30.05,3.9 v30.45,3.9
  Top 0.152: U1.5 27,46.65 26.81,46.83 26.72,46.83 26.37,47.18 v26.2,47.18 | v38,44.4 38.05,44.35 38.4,44.35 39.39,43.37 42.16,43.37 v42.5,43.7
  Bottom 0.127: D3.CATHODE 22.2,7.3 22.55,7.65 v22.7,7.65 | v30.45,3.9 30.73,4.18 32.77,4.18 36.54,7.95 39.5,7.95 40.3,8.75 40.3,13.11 41.89,14.75 44.11,14.75 45.65,16.27 45.65,41.1
  Bottom 0.152: v26.2,47.18 26.35,47.03 35.66,47.03 37.05,45.65 37.05,45.5 38,44.55 v38,44.4 | v42.5,43.7 43.05,43.7 45.65,41.1
LED2  (via drill 0.35)
  Top 0.152: U1.6 27,46.15 26.82,46.33 v26.65,46.15 | v38.02,43.58 38.33,43.58 38.85,43.05 42.1,43.05 v42.48,42.67
  Bottom 0.127: D2.CATHODE 23,5.96 23,4.47 32.59,4.47 36.4,8.23 36.42,8.25 39.3,8.25 40,8.95 40,13.25 41.77,15.03 43.99,15.03 45.37,16.41 45.37,40.51 43.2,42.67
  Bottom 0.152: v38.02,43.58 36.94,44.66 36.96,45.09 36.3,45.7 36.3,45.95 35.65,46.6 27.1,46.6 v26.65,46.15 | 43.2,42.67 v42.48,42.67
MOTOR1  (via drill 0.35)
  Top 0.152: U5.32 12.16,37.97 12.16,41.08 MOT1.P$1 | v9.65,45.9 20.15,45.9 20.9,45.15 U1.8
  Bottom 0.152: v9.65,45.9 9.65,43.95 MOT1.P$1
MOTOR2  (via drill 0.35)
  Top 0.152: U5.34 11.38,36.97 11.38,40.02 8.75,42.65 MOT2.P$1 | U1.9 20.5,44.65 19.8,45.35 v8.45,45.35
  Bottom 0.152: MOT2.P$1 8.45,43.6 v8.45,45.35
MOTOR3  (via drill 0.35)
  Top 0.152: U5.36 11.88,35.97 11,36.85 11,39.45 MOT3.P$1 | U1.10 20.15,44.15 19.5,44.8 v7.3,44.8
  Bottom 0.152: MOT3.P$1 7.3,43.35 v7.3,44.8
MOTOR_ENABLE
  Top 0.152: U1.11 27.75,43.75 20.1,43.75 19.4,44.45 13.42,44.45 12.62,43.65 12.62,39.3 U5.31
MOTOR_FAULT  (via drill 0.35)
  Top 0.127: 24.62,50.5 R14.P$2
  Top 0.152: U5.26 16.1,41.15 16.9,41.95 18.21,41.95 v18.21,41.97 | 24.62,50.5 21.6,47.48 v21.6,47.05 | U1.44 30.47,49.43 30.47,50.25 29.97,50.75 29.97,52.57 29.87,52.67 26.6,52.67 24.8,50.87 R14.P$2
  Route15 0.152: v18.21,41.97 21.6,45.36 v21.6,47.05
MOTOR_HIZ  (via drill 0.35)
  Top 0.152: U5.37 13.77,35.47 14,35.7 14,36.2 13.73,36.47 | 13.73,36.47 U5.35 | 13.73,36.47 14,36.74 14,37.3 13.83,37.47 U5.33 11.76,37.47 11.76,40.48 9.53,42.71 9.53,43.75 9.1,44.18 6.45,44.18 6.45,47.17 11.95,52.67 23.86,52.67 24.33,52.2 v24.95,52.2 | U1.45 30.05,50.23 29.66,50.62 29.66,52.33 29.65,52.34 27.2,52.34 v27,52.14
  Bottom 0.152: v27,52.14 25.16,52.14 25.1,52.2 v24.95,52.2
N$1
  Top 0.305: M3.P$1 3.5,11.5 R10.P$1 C55.P$1
N$2
  pour Top (no thermals): 12.05,34.1 13.8,34.1 13.8,33.65 13.45,33.3 12.9,33.3 12.25,33.3 12.05,33.5
N$3
  Bottom 0.61: R11.P$2 C64.P$1
N$4
  Top 0.203: C20.P$1 9.7,37.8
  Top 0.254: 9.7,37.8 U4.3
N$5
  Bottom 0.61: R12.P$1 C65.P$2
N$6
  Bottom 0.61: C66.P$1 R18.P$2
N$7
  Bottom 0.61: C67.P$2 R19.P$1
N$8
  Bottom 0.61: R20.P$2 C68.P$1
N$9
  Bottom 0.61: C69.P$2 R21.P$1
N$10
  Top 0.381: U5.1 13.68,32.9 13.15,32.9 12.75,32.5 C16.P$2
N$13
  pour Top (rank 2, no thermals): 14.45,33.55 14.75,33.55 14.75,32.95 14.7,32.95 14.3,32.55 14.3,31.9 13.6,31.9 13.6,32.45 13.75,32.6 13.9,32.6 14.45,33.15
N$14
  pour Top (rank 2, no thermals): 16,33.6 16.25,33.6 16.25,32.05 15.65,32.05 15.65,32.45 15.95,32.75 15.95,33.6
N$16
  Top 0.254: C17.P$2 12.33,34.97 U5.38
N$17
  Bottom 0.254: R1.P$2 21.15,6.05 D3.ANODE
N$18
  Bottom 0.254: D2.ANODE 24,5.15 R2.P$2
NRST
  Top 0.127: U1.7 27.75,45.62 25.9,45.62 C3.P$1 | SWD.2 16.75,47.62
  Top 0.152: 16.75,47.62 17.98,46.4 25.35,46.4 C3.P$1
SECONDARY_ENC_CS  (via drill 0.35)
  Top 0.152: U1.2 27.35,48.15 26.1,49.4 v26.1,49.55
  Bottom 0.152: v26.1,49.55 25.25,49.55 24.25,50.55 20.6,50.55 19,52.15 12.8,52.15 12.15,51.5 ENC.2
SHA  (via drill 0.35)
  Top 0.254: Q2.PAD 13.65,20.35 11.3,22.7 11.3,25.2 12.3,26.2 12.3,27.08 12.65,27.43 12.65,29.53 13.11,30.05 16.62,30.04 17.1,30.53 U5.7
  Bottom 0.61: v5.95,17.4 C64.P$2 | v11.6,17.4 C65.P$1
  pour Top (isolate 0.5, no thermals): 5.7,18.7 9.1,18.7 9.1,17.3 9.3,17.1 10.5,17.1 11,17.6 11,18.7 16.3,18.7 16.3,14.8 11.4,14.8 9.35,12.75 7.65,12.75 5.7,14.7
SHB  (via drill 0.35)
  Top 0.254: Q4.8 22.8,18.95 22.8,26.25 23.55,27 23.55,30.3 22.9,30.95 22.9,34.1 21.56,35.44 19.28,35.44 U5.14
  Bottom 0.61: v22.75,18.2 C67.P$1 | v26.9,16.9 28,18 C66.P$2
  pour Top (isolate 0.5, no thermals): 17.6,18.7 27.1,18.7 27.1,14.8 25.9,14.8 23.85,12.75 21.57,12.75 19.85,14.8 17.6,14.8
SHC  (via drill 0.35)
  Top 0.254: Q6.5 35.85,17.95 35.32,18.48 35.32,24.43 34.65,25.27 34.65,27.58 34.35,27.88 34.35,28.65 34.61,28.91 34.61,31.59 33.1,33.15 26.65,33.15 22.83,36.97 U5.17
  Bottom 0.61: C68.P$2 30.75,17.31 30.75,17.1 v30.85,17 | C69.P$1 35.55,18 v35.2,17.65
  pour Top (isolate 0.5, no thermals): 29.7,18.7 33.1,18.7 33.1,17.1 34.5,17.1 34.9,17.5 34.9,17.9 35.7,18.7 40.3,18.7 40.3,14.8 38.25,12.75 36.55,12.75 34.5,14.8 30.8,14.8 30.8,16.9 30.3,17.3 29.7,17.3
SWCLK  (via drill 0.35)
  Top 0.127: 12.25,48.1 12.25,47.75 SWD.5
  Top 0.152: v34,50.34 34.05,50.34 U1.37 | v22.1,51.45 20.65,50 14.15,50 12.25,48.1
  Bottom 0.152: v34,50.34 31.85,50.34 30.44,51.75 27.95,51.75 27.48,51.28 22.27,51.28 v22.1,51.45
SWDIO  (via drill 0.35)
  Top 0.127: 15.25,47.75 SWD.3
  Top 0.152: v34.82,50.37 34.75,50.37 U1.36 | v23.35,52.15 23.35,51.95 20.9,49.5 17,49.5 15.25,47.75
  Bottom 0.152: v34.82,50.37 33.81,51.38 33.75,51.38 33.67,51.3 31.32,51.3 30.52,52.1 27.8,52.1 27.31,51.61 23.89,51.61 v23.35,52.15
SXA_N
  Top 0.254: U5.10 18.6,33.2 19.52,32.28 19.53,30.16 17.78,28.44 15.94,28.44 15.5,28 15.5,26.95 SH1.1
SXA_P  (via drill 0.35)
  Top 0.254: U5.9 18.1,33.01 19.1,32.11 19.11,30.32 17.6,28.85 15.78,28.85 15.09,28.17 15.09,26.94 14.9,26.75 14.1,26.75 14.1,25.77 RA.2
  Top 0.305: v16.44,16.95 16.5,17.01 16.68,17.01 16.68,22.88 Q2.1
  Bottom 0.305: R12.P$2 16.44,17.97 v16.44,16.95
  pour Top (isolate 0.5, no thermals): 13,22.9 13,25.7 15.65,25.7 15.65,22.9
  pour Top (no thermals): 13.65,29.05 14.55,29.05 14.55,27.05 14.6,27 14.6,26.8 14.75,26.65 14.75,26.35 13.4,26.35 13.4,26.8 13.65,27.05
SXB_N
  Top 0.254: U5.11 20.16,33.97 21.42,32.71 21.42,31.26 22.64,30.04 22.64,27.64 21.9,26.9 21.23,26.9 SH2.1
SXB_P  (via drill 0.35)
  Top 0.254: U5.12 20.28,34.47 21.83,32.92 21.83,31.42 23.04,30.21 23.04,27.47 22.07,26.49 21.5,26.49 20.5,25.49 RB.2
  Top 0.305: v17.27,17.19 17.14,17.35 17.14,22.34 17.35,22.55 17.52,22.55 18.8,22.55 19.37,23.11 Q4.3
  Bottom 0.305: R19.P$2 17.27,17.71 v17.27,17.19
  pour Top (isolate 0.5, no thermals): 19,24 19.7,24.7 19.7,26.05 22.3,26.05 22.3,23 19,23
SXC_N
  Top 0.254: U5.20 20.06,38.47 20.11,38.42 23.4,38.42 27.23,34.6 34.52,34.6 37.05,32.07 37.05,29.65 36.02,28.62 36.02,27.74 37.02,27.74 SH3.1
SXC_P  (via drill 0.35)
  Top 0.254: U5.19 20.06,37.97 20.11,38.02 23.23,38.02 27.06,34.19 34.31,34.19 36.64,31.86 36.64,29.84 35.61,28.81 35.61,27.34 36.62,27.34 36.81,27.13 37.15,27.13 37.15,26.35 RC.2
  Top 0.305: v40.82,18.71 40.66,18.71 40.66,22.9 Q6.1
  Bottom 0.305: v40.82,18.71 40.66,18.71 R21.P$2
  pour Top (isolate 0.5, no thermals): 36.9,22.9 36.9,24.45 36.1,25.25 36.1,26.6 36.9,26.6 37.3,26.2 38.9,26.2 38.9,24.8 40.3,24.8 40.3,22.9
V+  (via drill 0.3)
  Top 0.127: R5.P$2 35.5,36.08 35.5,34.3 37.75,32.05 v37.85,32.05
  Top 0.254: v10.15,32.95 9.75,32.95 C19.P$1 | v15.25,31.8 v15.26,31.8 C15.P$1 14.87,32.2 C14.P$1
  other vias: 29.95,25.2 5.8,24.95 3.25,32.4 3.27,26.84 4.85,23.05 4.75,18.65 41.25,22.85 2.1,32.4 43.95,18.65 9.65,35.75 24,24.6 24.65,25.2 24.65,24.6 25.3,25.2 25.3,24.6 25.95,25.2 25.95,24.6 26.6,25.2 26.6,24.6 27.25,25.2 27.25,24.6 27.9,25.2 27.9,24.6 29.95,24.6 30.6,25.2 30.6,24.6 31.25,25.2 31.25,24.6 31.9,25.2 31.9,24.6 32.55,24.6 33.2,24.6 38.35,31.75 38.9,32.05 39.35,31 41.8,23.15 42.3,22.85 42.8,23.15 41.75,18.75 42.25,18.5 42.75,18.75 43.95,19.45 43.95,20.25 43.95,21.05 43.95,21.8 43.95,22.55 3.85,32.4 4.45,32.4 5.05,32.4 5.65,32.4 6.25,32.4 6.85,32.4 3.77,26.48 4.27,26.84 4.77,26.48 6.3,24.6 6.8,24.95 7.3,24.6 7.8,24.95 8.3,24.6 8.8,24.95 9.3,24.6 9.8,24.95 2.1,31.65 2.1,30.9 2.1,30.15 2.1,29.4 2.1,28.65 2.1,27.9 2.1,27.15 2.1,26.4 2.1,25.65 2.1,24.9 2.1,24.15 2.1,23.4 2.1,22.65 2.1,21.9 2.1,21.15 2.1,20.4 2.1,19.65 2.1,18.9 2.1,18.15 4.2,23.05 3.55,23.05 2.9,23.05 4.1,18.65 3.45,18.65 2.8,18.65 9.95,35.2 9.6,34.65 10,34.2 9.55,33.75 10.15,33.55 5.3,24.6 4.7,24.95 4.1,24.95 3.5,24.95 2.9,24.95 39.65,26.45 40.4,26.45 41.15,26.45 32.9,31.6 32.9,30.9 24.15,33 24.02,31.19 25.6,30.75 24.02,30.61
  pour Route15 (isolate 0.5, no thermals): 0.5,0.5 0.5,38.8 4.4,38.8 6.45,36.75 8.15,36.75 10.05,38.65 18.45,38.65 18.45,30.5 23.3,30.5 23.3,33.45 40.05,33.45 40.05,30.55 45.6,30.55 45.6,0.5
  pour Top (no thermals): 23.7,23.1 23.7,26.5 28.2,26.5 28.3,26.5 28.3,23.1
  pour Top (isolate 0.3, no thermals): 29.7,23.1 29.7,26.5 33.9,26.5 34.3,26.5 34.3,23.1
  pour Top (isolate 0.5, no thermals): 5.7,23.1 5.7,26.6 9.9,26.6 10.3,26.6 10.3,23.1
  pour Top (isolate 0.5, no thermals): 0.2,27.1 5.4,27.1 5.4,22.7 0.2,22.7
  pour Top (no thermals): 5.35,26.6 7.1,26.6 7.1,19.5 5.35,19.5
  pour Bottom (isolate 0.5, rank 2, no thermals): 3.5,25.5 42.75,25.5 42.75,17.7 3.5,17.7
  pour Top (no thermals): 0.25,33.65 7.25,33.65 7.35,33.55 7.35,32 0.25,32
  pour Top (isolate 0.5, no thermals): 0.2,20.25 7,20.25 7,19.3 5,19.3 5,18.2 0.2,18.2
  pour Top (isolate 0.5, no thermals): 0.3,33.85 2.7,33.85 2.7,17.75 0.3,17.75
  pour Top (isolate 0.5, no thermals): 37.05,32.35 39.45,32.35 39.45,30.75 37.05,30.75
  pour Top (isolate 0.5, no thermals): 41,24.05 45.45,24.05 45.45,22.75 41,22.75
  pour Top (isolate 0.5, no thermals): 41,20.05 45.45,20.05 45.45,18.3 41,18.3
  pour Top (isolate 0.5, no thermals): 41.9,26.85 41.9,26.05 43.5,24.45 43.5,17.95 45.75,17.95 45.75,26.85
  pour Top (isolate 0.5, no thermals): 8.8,35.95 10.15,35.95 10.15,33.95 8.8,33.95
  pour Top (no thermals): 9.05,34.2 10.35,34.2 10.35,32.7 8.95,32.7 8.95,34.1
  pour Top (no thermals): 8.21,37.36 8.89,37.36 8.89,36.95 9.95,35.9 9.95,35.75 8.7,35.75 8.65,35.8 8.65,36.27 8.21,36.7
  pour Bottom (isolate 0.4, no thermals): 6.15,15.65 11.2,15.7 14.35,12.55 14.35,11.6 26.23,11.6 26.23,17.12 23.75,19.6 6.2,19.6 6.2,18.15
  pour Bottom (isolate 0.4, no thermals): 23.83,19.2 38.75,19.2 41.05,19.15 41.05,16.3 38.75,14 38.75,11.6 31.3,11.6 31.3,12.35 24.05,12.35
  pour Top (isolate 0.5, no thermals): 39.3,27.6 41.3,27.6 41.3,25.2 39.3,25.2
  pour Top (isolate 0.3, rank 2, no thermals): 31.7,32.1 32.75,32.1 34,30.85 34,30.45 31.7,30.45
  pour Top (no thermals): 15,33.6 15.7,33.6 15.7,33.1 15.65,33.05 15.65,32.95 15.35,32.65 15.35,31.75 14.65,31.75 14.65,32.45 15,32.8
  pour Top (rank 2, no thermals): 10.7,29.2 11.55,29.2 11.6,29.15 11.6,27.75 11.55,27.7 11.55,27.2 10.7,26.35 9.85,25.5 9.45,25.5 8.6,25.5 8.6,26.65 8.7,26.75 9.9,26.75 10.8,27.65 10.8,29.1
  pour Top (no thermals): 23.95,33.2 24.2,33.2 25.25,32.15 25.25,31.2 25.4,31.2 25.95,30.65 25.95,30.55 23.95,30.55
V-  (via drill 0.25, 0.3, 1)
  Top 0.127: RC.1 37.55,28.3 37.12,28.3 SH3.2
  Top 0.216: U5.39 15.6,34.47
  Top 0.254: C19.P$2 8.15,33.45 v7.85,33.45 | U5.PAD U5.P14 | 15.6,34.47 U5.P8 | SH2.2 20.5,27.89 RB.1 | v16.55,27.25 16.76,27.04 RA.1 16.46,26.07 16.46,26.24 SH1.2
  Top 0.305: R10.P$2 C55.P$2 7.6,9.1 v7.35,8.85
  Top 0.381: D5.2 18.05,26.45 v17.85,26.65 | D6.2 37.55,28.3
  other vias: 17.85,27.25 3.25,31.35 4.7,21.8 4.75,17.4 37.8,33.1 41.3,21.8 14.25,31.18 11.1,32.85 24.25,29.62 30.25,30 7.8,34.7 7.8,35.35 6.3,34.7 6.3,35.35 17.2,27.25 17.85,25.35 17.85,26 17.2,27.85 17.85,27.85 20.35,26.9 19.75,26.9 20.5,29.25 21.1,29.25 39.05,29.4 38.75,29.9 37.7,29.4 38.4,29.4 38.05,27.15 38.7,27.15 24.72,29.95 25.16,29.6 25.6,29.95 26.05,29.6 24.25,27.65 24.7,28.1 25.15,27.65 25.6,28.1 26.05,27.65 26.5,28.1 26.95,27.65 27.4,28.1 27.85,27.65 38.45,33.1 41.95,21.8 42.6,21.8 41.7,17.35 42.2,17.65 42.7,17.35 30.75,28.1 31.1,27.65 31.5,28.1 31.95,27.65 32.45,28.1 30.75,29.6 31.3,30 31.8,29.6 32.35,30 9.8,29.5 9.35,29.95 8.9,29.5 8.45,29.95 8.05,29.5 9.4,27.9 8.85,27.65 8.25,27.9 7.7,27.65 7.15,27.9 6.6,27.65 6.05,27.9 5.5,27.65 4.95,27.9 4.4,27.7 3.85,27.9 3.3,27.65 3.8,31.05 4.35,31.35 4.9,31.05 5.45,31.35 6,31.05 6.55,31.35 7.1,31.05 7.65,31.35 4.1,21.8 3.5,21.8 4.15,17.4 3.5,17.4 38.05,29.9 8,34.1 39.6,29.25 41.05,29.25 40.3,29.25 37.1,34.05 30.1,31.65 30.1,30.9 30.8,31.65 30.8,30.9 11.7,32.85 11.11,34.44 11.1,35.85 8.9,31.4 9.65,31.4 8.9,30.7 9.65,30.7 13.65,31.18 13.05,31.18 28.95,35.55 28,35.55 27.35,35.55 30.05,35.55 31.05,35.55 31.7,35.55 32.45,35.55 33.15,35.55 21.5,29.9 21.75,29.25 21.9,28.7 21.9,28.1 26.8,31.9 41.2,17.65
  pour Route2 (isolate 0.5, no thermals): 0.5,0.5 0.5,38.9 4.6,38.9 6.65,36.85 7.9,36.85 9.8,38.75 18.6,38.75 18.6,34.15 22.35,30.4 26.45,30.4 26.45,35.6 33.2,35.6 33.2,35.65 35.85,33.05 36.1,33.3 37.03,34.3 40.2,34.3 40.2,30.85 45.45,30.85 45.45,0.5
  pour Top (isolate 0.5, rank 2, no thermals): 37,30.1 37,26.6 38.95,26.6 38.95,30.1
  pour Top (isolate 0.5, rank 3, no thermals): 5.8,30.2 10.8,30.2 10.8,27.4 5.8,27.4
  pour Top (isolate 0.5, no thermals): 24,30.25 28.2,30.25 28.2,27.3 24,27.3
  pour Top (isolate 0.4, no thermals): 29.85,27.3 29.85,30.25 33,30.25 33,27.3
  pour Bottom (isolate 0.3, no thermals): 1.8,26.7 1.8,31.8 43.4,31.8 43.4,26.7
  pour Top (no thermals): 3.05,31.6 7.9,31.6 7.9,27.4 3.05,27.4
  pour Top (isolate 0.5, no thermals): 3.05,22.4 4.95,22.4 4.95,20.65 3.05,20.65
  pour Top (isolate 0.5, no thermals): 3.25,17.9 5,17.9 5,16.2 3.25,16.2
  pour Top (isolate 0.5, no thermals): 36.6,34.3 39.25,34.3 39.25,32.65 36.6,32.65
  pour Top (isolate 0.5, no thermals): 41,22.35 42.85,22.35 42.85,20.65 41,20.65
  pour Top (no thermals): 41,17.85 43,17.85 43,16.05 41,16.05
  pour Top (isolate 0.5, no thermals): 6,35.35 6.6,35.95 8.25,35.95 8.25,34.35 6,34.35
  pour Top (no thermals): 6.95,34.5 8.25,34.5 8.3,34.45 8.3,33.95 8.3,33.9 8.6,33.6 8.6,33.2 7.7,33.2 7.65,33.25 7.65,33.85 7.55,33.95 6.95,33.95
  pour Top (isolate 0.5, no thermals): 15.85,27.85 16.09,28.09 18.2,28.1 18.2,25.2 17.7,24.7 16.05,24.7 16.05,26.9 15.85,27.1
  pour Top (isolate 0.5, no thermals): 19.25,29.05 19.5,29.3 20.18,30.11 22.05,30.11 22.4,29.76 22.4,27.45 20.7,27.45 20.7,26.35 19.25,26.35
  pour Top (isolate 0.5, no thermals): 38.9,30 41.55,30 41.55,27.95 38.9,27.95
  pour Top (isolate 0.3, no thermals): 26.6,32.2 31.15,32.2 31.15,30.15 28.3,30.15 26.6,31.85
  pour Bottom (isolate 0.3, rank 2, no thermals): 9.35,39.85 19.95,39.85 20.55,39.25 20.55,29.1 9.35,29.1
  pour Top (isolate 0.3, no thermals): 10.8,36.15 11.6,36.15 11.6,33.5 12.15,32.95 12.15,32.05 10.8,32.05
  pour Top (isolate 0.5, no thermals): 8.3,32.35 9.95,32.35 9.95,30.15 8.3,30.15
  pour Bottom (no thermals): 20.1,37.55 21.85,35.8 33.15,35.8 34.6,34.35 39.5,34.35 39.5,31.65 25.45,31.65 25.45,32.5 24.65,33.3 20.1,33.3
  pour Bottom (isolate 0.5, no thermals): 17.4,27.95 18.35,27.95 18.35,25 17.4,25
  pour Top (no thermals): 12.8,31.35 15,31.35 15.15,31.2 15.15,31 15.1,30.95 12.8,30.95
VBAT_SENSE
  Top 0.254: R5.P$1 R6.P$2 35.06,38.56 C57.P$1 35,39.9 35,42.9 U1.25
VSW
  pour Top (no thermals): 3.15,36.85 6.9,36.85 6.9,36.4 6.25,36.4 5.45,35.6 3.15,35.6
VTEMP_FET  (via drill 0.3, 0.35)
  Top 0.127: 29,16.5 27.88,16.5 C13.P$1 | 29,16.5 29.38,16.5 | 29.38,16.5 30.12,16.5 R8.P$2 | 29,16.5 R9.P$1 | v35.5,46.05 35.5,46.12 34.75,46.12 U1.31 | v29.57,29.96 29.62,29.91 29.59,29.93 29.57,29.64 30.2,29.02 30.2,27.25 29.6,26.65 29.6,25.65 29.38,25.43 29.38,16.5
  Route15 0.127: v29.57,29.96 29.57,32.12 32.5,35.05 v36.4,35.05
  Bottom 0.127: v35.5,46.05 36.62,44.92 36.62,35.27 v36.4,35.05
VTEMP_MOT  (via drill 0.35)
  Top 0.127: R7.P$1 38.5,52.25 37.25,52.25 TEMP2.P$1
  Top 0.152: v37.48,47.48 37.48,47.18 36.41,46.11 36.41,46.05 35.9,45.54 34.86,45.54 U1.30
  Bottom 0.152: TEMP2.P$1 37.2,48.5 37.36,48.34 37.36,47.6 v37.48,47.48

## Text on the board
tPlace: SER | R | T | G | TEMP | DBG | 1 | 3V | 3 | 2 | MOT | SPI | DAC | 3 | 2 | 1 | G | C | K | MO | MI | moteus r4.10 | (c) 2021 | A | B | C | CAN | L | H | G
tNames: G | 3
bNames: 3 | C | G | K | I | O | G | L | H | G | L | H